# EAGLE design half-pint-turbidimeter_power (EAGLE 7.3.0)
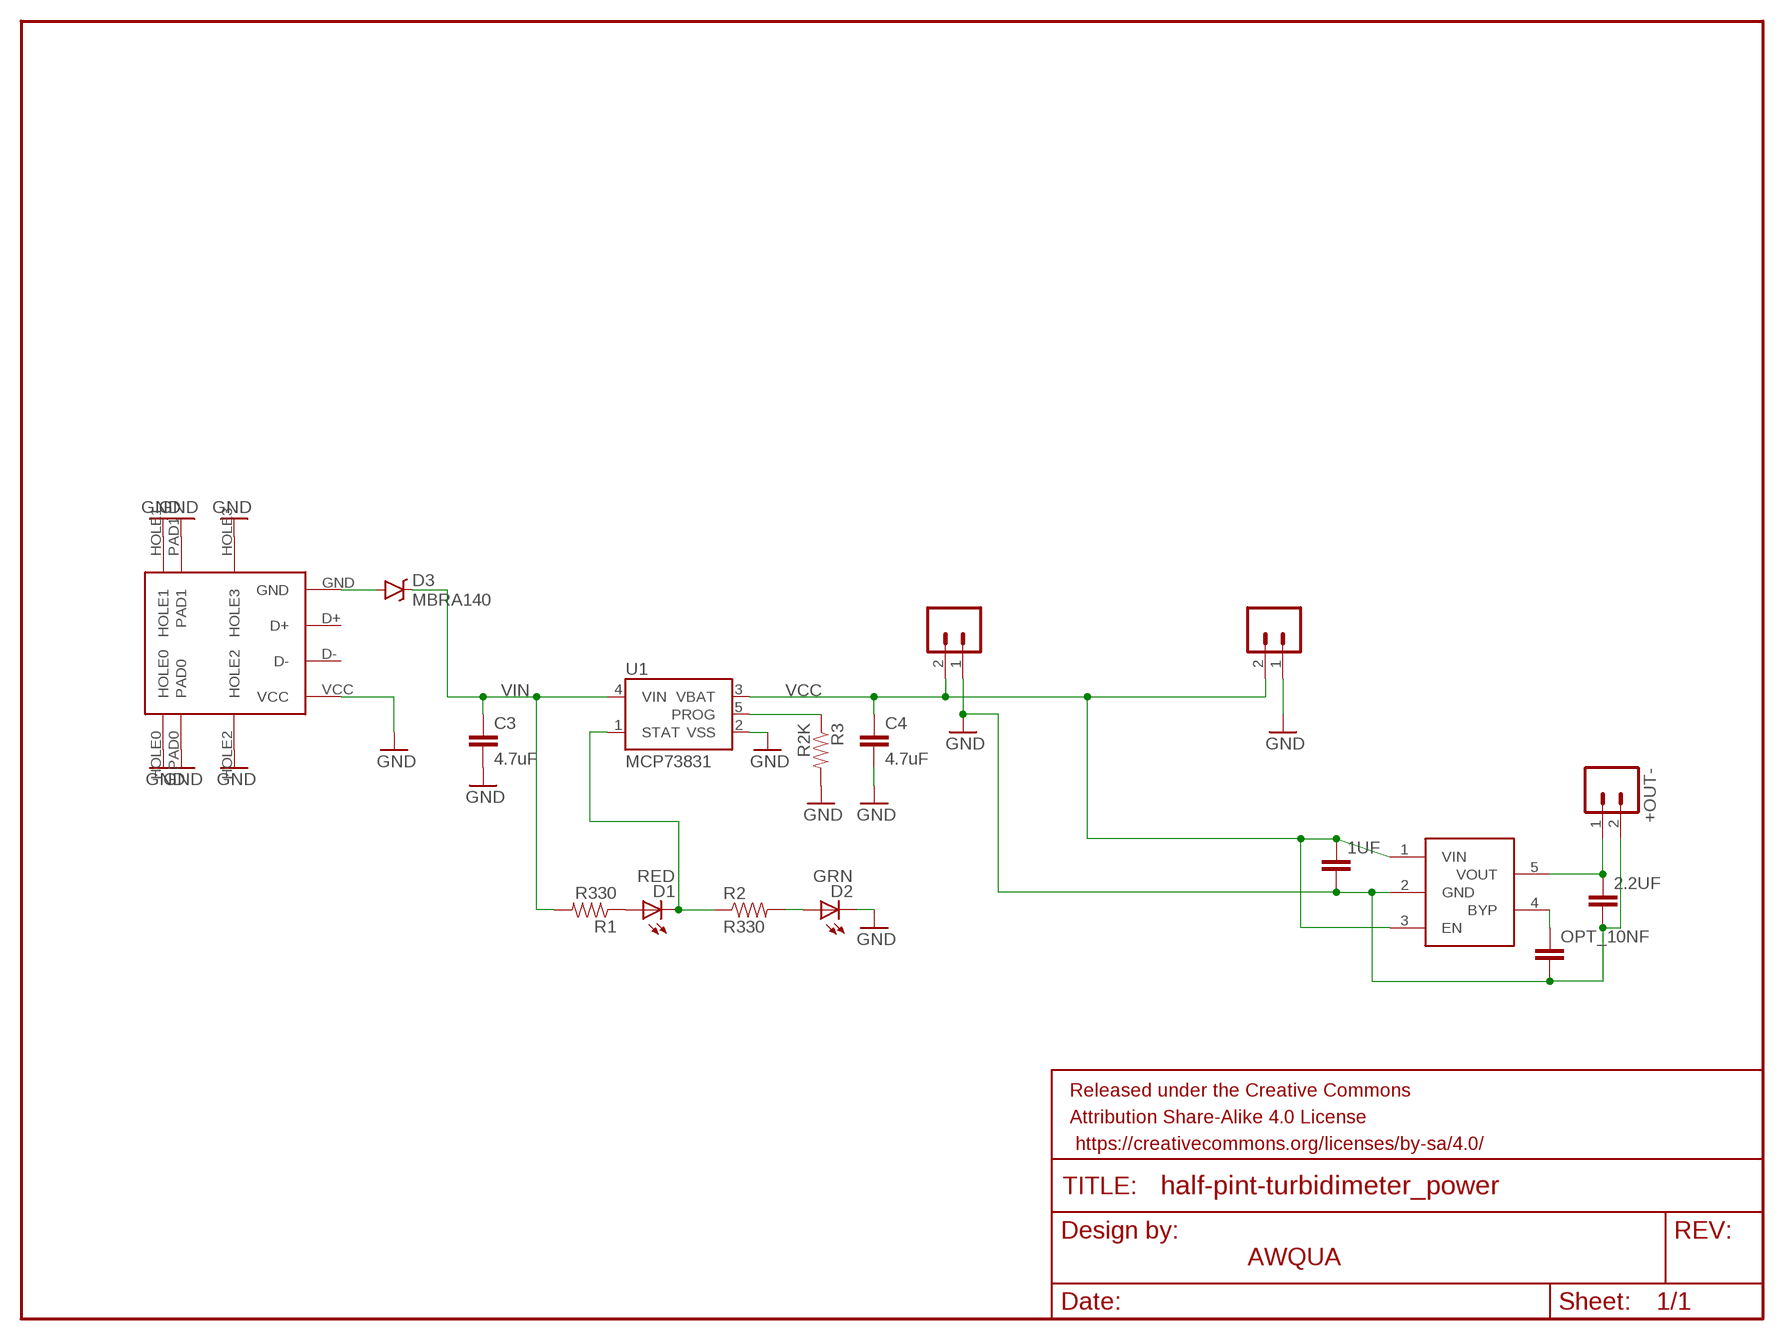
[diagram p0: schematic, sheet 1]

## Parts
1UF  CAP0603-CAP  [0603-CAP]
2.2UF  CAP0603-CAP  [0603-CAP]
+OUT-  M02PTH  [1X02]
C3  4.7uF  CAP0402-CAP  [0402-CAP]
C4  4.7uF  CAP0402-CAP  [0402-CAP]
D1  RED  LED0603  [LED-0603]
D2  GRN  LED0603  [LED-0603]
D3  MBRA140  [SMA-DIODE]
FRAME1  FRAME-LETTER  [CREATIVE_COMMONS]
JMP  M02PTH  [1X02]
JP7  LiPo Battery  M02-JST-2MM-SMT  [JST-2-SMD]
OPT_10NF  CAP0603-CAP  [0603-CAP]
R1  R330  RESISTOR0402-RES  [0402-RES]
R2  R330  RESISTOR0402-RES  [0402-RES]
R3  R2K  RESISTOR0402-RES  [0402-RES]
U1  MCP73831  [SOT23-5]
U$2  LP2985  [LP2985]
U$3  USBMICRO-DX4R005JJ2  [USBMICRO-DX4R005JJ2]

## Nets
GND: 1UF.2 2.2UF.2 +OUT-.2 C3.2 C4.2 D2.C JMP.1 JP7.1 OPT_10NF.2 R3.2 U1.2(VSS) U$2.2(GND) U$3.HOLE0 U$3.HOLE1 U$3.HOLE2 U$3.HOLE3 U$3.PAD0 U$3.PAD1 U$3.VCC
N$1: OPT_10NF.1 U$2.4(BYP)
N$2: D2.A R2.2
N$3: D1.A R1.1
N$4: 2.2UF.1 +OUT-.1 U$2.5(VOUT)
N$5: D3.A U$3.GND
PROG: R3.1 U1.5(PROG)
STAT: D1.C R2.1 U1.1(STAT)
VCC: 1UF.1 C4.1 JMP.2 JP7.2 U1.3(VBAT) U$2.1(VIN) U$2.3(EN)
VIN: C3.1 D3.C R1.2 U1.4(VIN)
Unconnected: U$3.D+ U$3.D-

## Notes on the sheet
- AWQUA

## Library data of the parts
1UF 2.2UF OPT_10NF = SparkFun-Passives:CAP: Capacitor Standard 0603 ceramic capacitor, and 0.1" leaded capacitor.
+OUT- = SparkFun-Connectors:M02: Standard 2-pin 0.1" header. Use with - straight break away headers ( PRT-00116) - right angle break away headers (PRT-00553) - swiss pins (PRT-00743) - machine pins (PRT-00117) - female headers (PRT-00115) Molex polarized connector foot print use with: PRT-08233 with associated crimp pins and housings. 2.54_SCREWTERM for use with PRT-10571. 3.5mm Screw Terminal footprints for PRT-08084 5mm Screw Terminal footprints for use with PRT-08432
C3 C4 = SparkFun:CAP: Capacitor Standard 0603 ceramic capacitor, and 0.1" leaded capacitor.
D1 D2 = SparkFun:LED: LEDs Standard schematic elements and footprints for 5mm, 3mm, 1206, and 0603 sized LEDs. 5mm - Spark Fun Electronics SKU : COM-00529 (and others)
D3 = SparkFun-DiscreteSemi:MBRA140: 40V, 1A Schottky rectifier SMA/DO-214AC package DIO-08053; PROD_ID: DIO-08053
FRAME1 = SparkFun-Aesthetics:FRAME-LETTER: Schematic Frame Standard 8.5x11 US Letter frame
JMP JP7 = SparkFun:M02: Header 2 Standard 2-pin 0.1" header. Use with straight break away headers (SKU : PRT-00116), right angle break away headers (PRT-00553), swiss pins (PRT-00743), machine pins (PRT-00117), and female headers (PRT-00115). Molex polarized connector foot print use with SKU : PRT-08233 with associated crimp pins and housings.
R1-R3 = SparkFun:RESISTOR: Resistor Basic schematic elements and footprints for 0603, 1206, and PTH resistors.
U1 = SparkFun:MCP73831: Microchip's MCP73831 Miniature single cell, fully integrated Li-Ion, Li-polymer charge management controller http://ww1.microchip.com/downloads/en/DeviceDoc/21984a.pdf
U$2 = awqua_eagle_library:LP2985
U$3 = awqua_eagle_library:USBMICRO-DX4R005JJ2

## Board
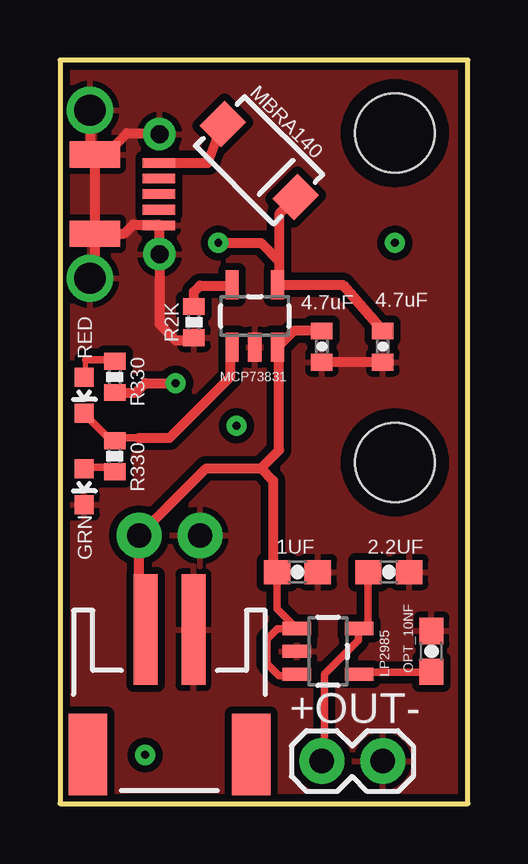
[diagram p1: board, top side]
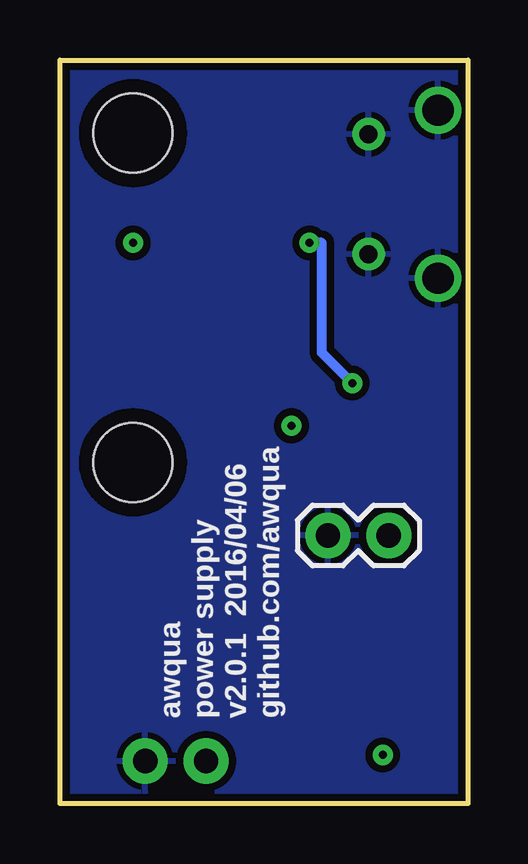
[diagram p2: board, bottom side, seen from below]

Size 17.02 x 30.99 mm. Coordinates in mm from the lower left corner, seen from the top.
Outline: 17.02,0 17.02,30.99 0,30.99 0,0 17.02,0
Copper layers (1*16): Top 0.035mm / dielectric 1.5mm / Bottom 0.035mm
Design rules "SparkFun": minimum track width 8mil, minimum drill 20mil, track to track 8mil, track to pad 8mil, pad to pad 8mil, via to via 8mil, smd to smd 6mil, copper to edge 8mil, drill to drill 8mil, minimum pad ring 12mil, minimum via ring 10mil, stop-mask expansion 4mil, vias tented up to drill 25mil, thermal gap 10mil

### Footprints (pad centres in the part's own frame; a part is rotated, then mirrored left to right if it is on the bottom)
0603-CAP = smd 1.1 x 1: 1 -0.85,0; 2 0.85,0
1X02 = drill 1.016 pad 1.88: 1 0,0; 2 2.54,0
0402-CAP = smd 0.7 x 0.9: 1 -0.65,0; 2 0.65,0
LED-0603 = smd 0.8 x 0.8: A 0,-0.75; C 0,0.75
SMA-DIODE = smd 1.27 x 1.47: A -2.15,0; C 2.15,0
STAND-OFF = hole 3.302: 0,0
JST-2-SMD = smd 1 x 4.6: 1 -1,-3.7; 2 1,-3.7 | smd 1.6 x 3.4: NC1 -3.4,1.5; NC2 3.4,1.5
0402-RES = smd 0.7 x 0.9: 1 -0.65,0; 2 0.65,0
SOT23-5 = smd 0.55 x 1.2: 1 -0.95,-1.3; 2 0,-1.3; 3 0.95,-1.3; 4 0.95,1.3; 5 -0.95,1.3
LP2985 = smd 0.55 x 1.2: 1 0.32,-0.03; 2 1.27,-0.03; 3 2.22,-0.03; 4 2.22,2.57; 5 0.32,2.57
USBMICRO-DX4R005JJ2 = smd 0.4 x 1.35: D+ 0,4.125; D- 0.65,4.125; DNP -0.65,4.125; GND -1.3,4.125; VCC 1.3,4.125 | drill 1.3 pad 1.9: HOLE0 3.5,1.25; HOLE1 -3.5,1.25 | drill 0.75 pad 1.15: HOLE2 2.5,4.15; HOLE3 -2.5,4.15 | smd 1.1 x 2.1: PAD0 1.65,1.45; PAD1 -1.65,1.45

### Placement (x,y rotation side)
1UF  9.91,9.65 0 top
2.2UF  13.72,9.65 0 top
+OUT-  10.92,1.78 0 top
C3  13.46,19.05 270 top
C4  10.92,19.05 270 top
D1  1.02,17.02 180 top
D2  1.02,13.21 180 top
D3  8.31,26.81 315 top
FRAME1  -14.48,-19.56 0 top  (outside the outline)
JMP  5.84,11.18 0 bottom
JP1  STAND-OFF  [STAND-OFF]  13.97,14.22 0 top
JP3  STAND-OFF  [STAND-OFF]  13.97,27.94 0 top
JP7  4.57,3.56 180 top
OPT_10NF  15.49,6.35 90 top
R1  2.29,17.78 270 top
R2  2.29,14.48 270 top
R3  5.59,20.07 270 top
U1  8.13,20.32 0 top
U$1  [CREATIVE_COMMONS]  -14.48,-10.92 0 top  (outside the outline)
U$2  9.91,7.62 270 top
U$3  0,25.4 270 top

### Tracks (layer width: path | path; a pad name or v marks a point on that pad's centre or on a via)
GND
  Top 0.406: U$3.HOLE1 1.25,27.25 U$3.PAD1 | U$3.PAD1 U$3.PAD0 | U$3.PAD0 1.45,22.1 U$3.HOLE0 | U$3.PAD0 2.67,23.75 3.05,24.13 4.1,24.13 U$3.VCC 4.15,24.07 U$3.HOLE2 4.15,19.98 4.83,19.3 5.48,19.3 R3.2 | U$3.PAD1 1.9,27.05 2.79,27.94 4.11,27.94 U$3.HOLE3 | C3.2 C4.2
  pour Bottom (isolate 0.305): 0,-0.51 -0.51,33.02 17.53,33.53 18.03,0
  pour Top (isolate 0.305): -2.54,31.75 17.27,33.02 17.78,-0.25 -2.03,-1.52
N$1
  Top 0.203: 15.49,5.49 OPT_10NF.1 | 12.65,5.49 U$2.4
  Top 0.305: 12.65,5.49 15.49,5.49
N$2
  Top 0.203: 1.07,14.02 D2.A | 2.29,14.02 R2.2
  Top 0.305: 2.29,14.02 1.07,14.02
N$3
  Top 0.203: 1.07,18.49 D1.A | 2.29,18.49 R1.1
  Top 0.305: 2.29,18.49 1.07,18.49
N$4
  Top 0.203: 12.85,7.52 12.65,7.32 U$2.5 12.45,7.11 | 12.85,9.55 2.2UF.1 | 11.02,1.83 +OUT-.1
  Top 0.305: 12.85,7.52 12.85,9.55 | 12.45,7.11 12.45,6.81 11.02,5.38 11.02,1.83
N$5
  Top 0.406: U$3.GND 6.18,26.7 D3.A
N$6  (via drill 0.33)
  other vias: 7.37,15.75
N$7  (via drill 0.33)
  other vias: 13.97,23.37
N$8  (via drill 0.33)
  other vias: 3.56,2.03
PROG
  Top 0.406: R3.1 5.59,21.34 5.84,21.59 7.15,21.59 U1.5
STAT
  Top 0.305: D1.C 1.02,16.26 2.14,15.13 R2.1 2.4,15.24 3.3,15.24 | U1.1 7.08,19.02
  Top 0.406: 3.3,15.24 4.57,15.24 7.11,17.78 7.11,18.95 U1.1
VCC
  Top 0.203: 3.3,7.52 3.51,7.32 JP7.2
  Top 0.305: 1UF.1 9.06,8.12 U$2.1 9.08,7.3 8.64,6.86 8.64,5.84 9.14,5.33 9.81,5.33 U$2.3
  Top 0.406: 3.3,7.52 JMP.2 6.1,13.97 8.38,13.97 | 8.38,13.97 8.89,13.46 8.89,9.82 1UF.1 | 8.38,13.97 9.14,14.73 9.14,18.95 U1.3 9.76,19.7 C4.1
VIN  (via drill 0.33)
  Top 0.406: D3.C 9.14,24.56 9.14,22.61 | 9.14,22.61 9.14,21.69 U1.4 11.8,21.62 C3.1 | R1.2 3.16,17.13 3.56,17.53 v4.83,17.53 | v6.6,23.37 8.38,23.37 9.14,22.61
  Bottom 0.406: v4.83,17.53 6.1,18.8 6.1,23.37 v6.6,23.37

### Text on the board
bPlace: awqua / power supply / v2.0.1 2016/04/06 / github.com/awqua
tNames: AWQUA